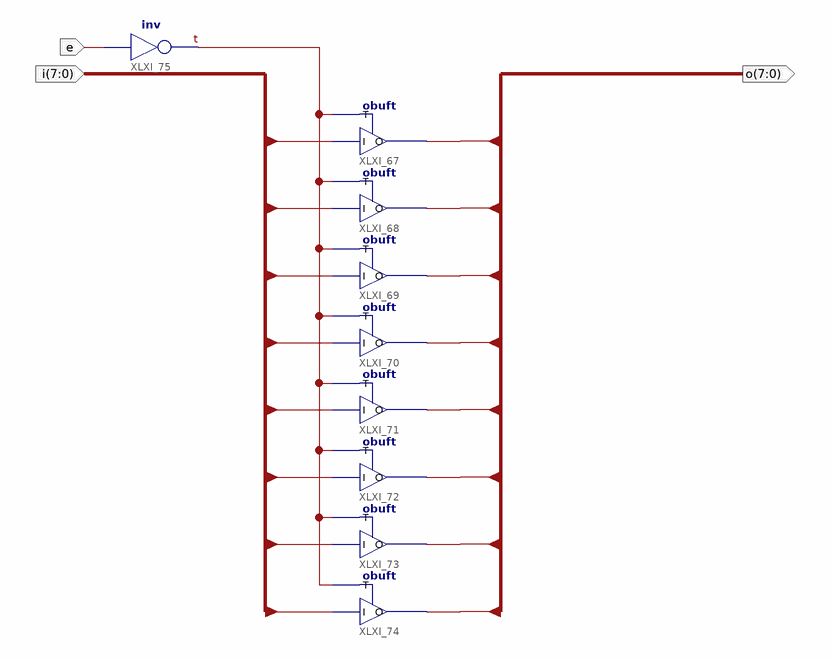
[diagram p0: schematic sheet 1]
// Xilinx ISE schematic buffer_8bit.sch (aspartan6) as structural Verilog: 9 symbols, 3 ports
module buffer_8bit (
  input  [7:0] i,
  input  e,
  output [7:0] o
);

  wire t;

  obuft XLXI_67 (.I(i[0]), .T(t), .O(o[0]));
  obuft XLXI_68 (.I(i[1]), .T(t), .O(o[1]));
  obuft XLXI_69 (.I(i[2]), .T(t), .O(o[2]));
  obuft XLXI_70 (.I(i[3]), .T(t), .O(o[3]));
  obuft XLXI_71 (.I(i[4]), .T(t), .O(o[4]));
  obuft XLXI_72 (.I(i[5]), .T(t), .O(o[5]));
  obuft XLXI_73 (.I(i[6]), .T(t), .O(o[6]));
  obuft XLXI_74 (.I(i[7]), .T(t), .O(o[7]));
  not XLXI_75 (t, e);
endmodule
